# EAGLE design contactoRef (EAGLE 9.1.3)
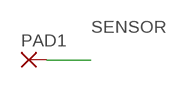
[diagram p0: schematic, sheet 1]

## Parts
PAD1  1,6/0,9  [1,6/0,9]

## Nets
SENSOR: PAD1.1(P)

## Library data of the parts
PAD1 = wirepad:1,6/0,9: THROUGH-HOLE PAD

## Board
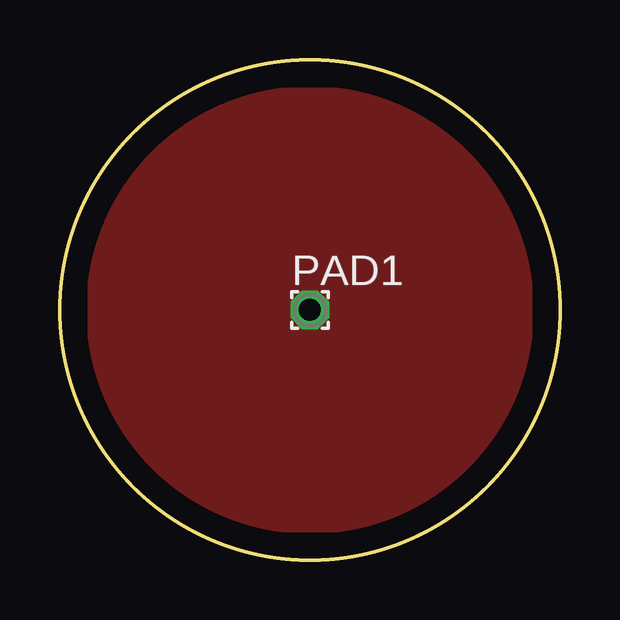
[diagram p1: board, top side]
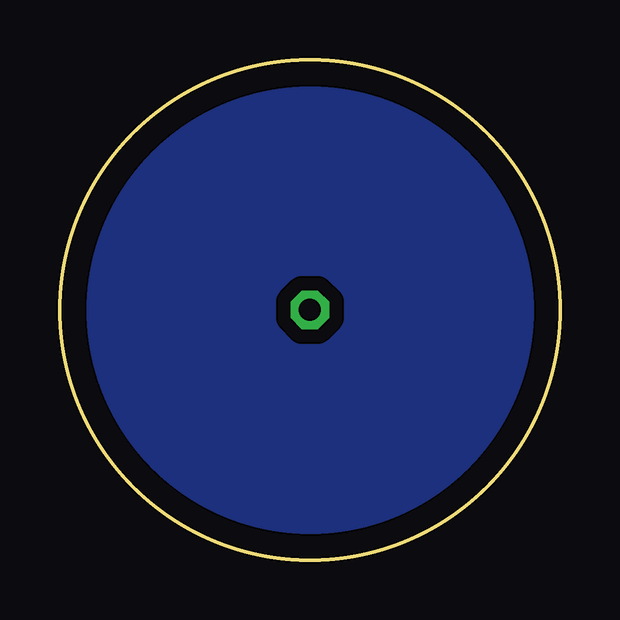
[diagram p2: board, bottom side, seen from below]

Size 20.83 x 20.83 mm. Coordinates in mm from the lower left corner, seen from the top.
Outline: circle at 10.41,10.41 radius 10.41
Copper layers (1*16): Top 0.035mm / dielectric 1.5mm / Bottom 0.035mm
Design rules "default": minimum track width 6mil, minimum drill 0.35mm, track to track 6mil, track to pad 6mil, pad to pad 6mil, via to via 6mil, smd to smd 6mil, copper to edge 40mil, drill to drill 6mil, minimum pad ring 10mil, minimum via ring 8mil, stop-mask expansion 4mil, vias tented up to drill 0mil, thermal gap 10mil

### Footprints (pad centres in the part's own frame; a part is rotated, then mirrored left to right if it is on the bottom)
1,6/0,9 = drill 0.914 pad 1.6 octagon: 1 0,0

### Placement (x,y rotation side)
PAD1  10.41,10.41 0 top

### Tracks (layer width: path | path; a pad name or v marks a point on that pad's centre or on a via)
GND
  pour Bottom (isolate 0.61): 8.93,20.64 7.92,20.45 arc24 4.83,19.13 arc35 0.63,13.59 arc50 1.48,5.24 arc122 19.8,5.88 arc30 20.76,10.45 arc45 16.98,18.3 arc51
SENSOR
  pour Top: 10.52,20.8 8.59,20.6 arc36 4.03,18.56 arc23 0.89,14.29 arc51 0.94,6.31 arc34 5.32,1.53 arc91 19.39,5.29 arc34 20.74,11.52 arc91 9.61,20.8